# Altium schematic sheet dcmotor.SchDoc
size A4
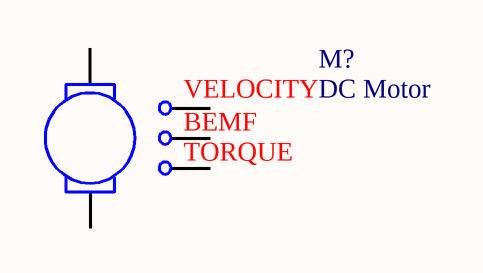
[diagram p0: dcmotor.SchDoc]

## Parts
M?  DC Motor

## Nets

Not connected (* = marked no-connect by the designer): M? 1 2 3 4 5

## Notes on the sheet
- (in symbol DC Motor) VELOCITY; BEMF; TORQUE

## Library data of the parts
M? = DC Motor: LA: 1.5M; RA: 0.5; KE: 0.05; JM: 250U; BM: 0.1M; TL: 0; SimulationGenericComponent: True; KT: 0.05